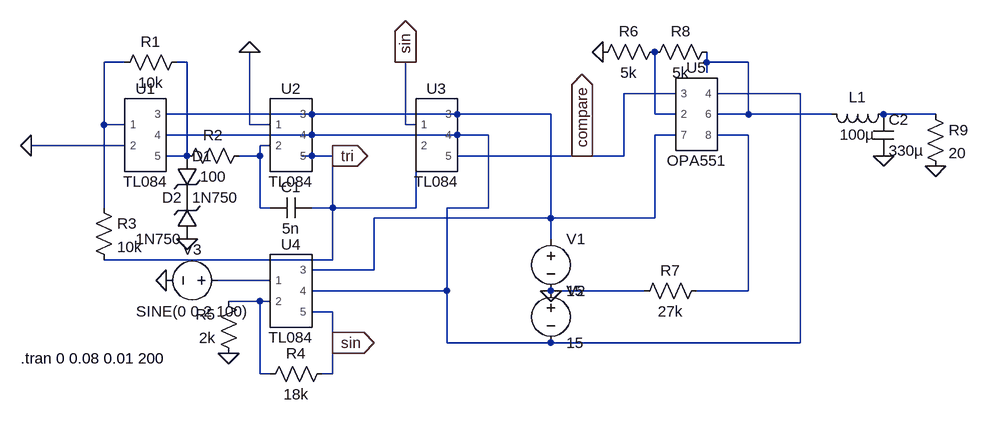
[diagram p0: schematic d类功放思考题.asc]
d类功放思考题.asc, the LTspice schematic file:
Version 4
SHEET 1 1368 680
WIRE 64 -16 32 -16
WIRE 160 -16 144 -16
WIRE 960 -16 960 -32
WIRE 1024 -16 960 -16
WIRE 960 0 960 -16
WIRE 912 32 832 32
WIRE 1104 32 976 32
WIRE 352 64 128 64
WIRE 576 64 352 64
WIRE 720 64 576 64
WIRE 880 64 880 -32
WIRE 912 64 880 64
WIRE 1024 64 1024 -16
WIRE 1024 64 976 64
WIRE 1152 64 1024 64
WIRE 1312 64 1232 64
WIRE 32 80 32 -16
WIRE 64 80 32 80
WIRE 256 80 256 -32
WIRE 288 80 256 80
WIRE 496 80 496 -16
WIRE 512 80 496 80
WIRE 352 96 128 96
WIRE 576 96 352 96
WIRE 624 96 576 96
WIRE 912 96 880 96
WIRE 1024 96 976 96
WIRE 64 112 -80 112
WIRE 288 112 272 112
WIRE 160 128 160 -16
WIRE 160 128 128 128
WIRE 272 128 272 112
WIRE 272 128 240 128
WIRE 352 128 336 128
WIRE 384 128 352 128
WIRE 768 128 576 128
WIRE 832 128 832 32
WIRE 832 128 768 128
WIRE 32 208 32 80
WIRE 272 208 272 128
WIRE 288 208 272 208
WIRE 384 208 384 128
WIRE 384 208 352 208
WIRE 512 208 512 112
WIRE 512 208 384 208
WIRE 624 208 624 96
WIRE 624 208 560 208
WIRE 720 224 720 64
WIRE 720 224 448 224
WIRE 880 224 880 96
WIRE 880 224 720 224
WIRE 720 256 720 224
WIRE 384 288 384 208
WIRE 384 288 32 288
WIRE 448 304 448 224
WIRE 448 304 352 304
WIRE 288 320 208 320
WIRE 560 336 560 208
WIRE 560 336 352 336
WIRE 864 336 720 336
WIRE 1024 336 1024 96
WIRE 1024 336 944 336
WIRE 272 352 224 352
WIRE 288 352 272 352
WIRE 384 368 352 368
WIRE 384 416 384 368
WIRE 560 416 560 336
WIRE 720 416 560 416
WIRE 1104 416 1104 32
WIRE 1104 416 720 416
WIRE 272 464 272 352
WIRE 288 464 272 464
WIRE 384 464 384 416
WIRE 384 464 368 464
FLAG 720 336 0
FLAG -80 112 0
FLAG 160 256 0
FLAG 256 -32 0
FLAG 384 128 tri
IOPIN 384 128 Out
FLAG 128 320 0
FLAG 224 432 0
FLAG 384 416 sin
IOPIN 384 416 Out
FLAG 496 -16 sin
IOPIN 496 -16 Out
FLAG 768 128 compare
IOPIN 768 128 Out
FLAG 800 -32 0
FLAG 1232 128 0
FLAG 1312 144 0
SYMBOL TL084 96 96 R0
SYMATTR InstName U1
SYMBOL TL084 320 96 R0
SYMATTR InstName U2
SYMBOL TL084 544 96 R0
SYMATTR InstName U3
SYMBOL TL084 320 336 R0
SYMATTR InstName U4
SYMBOL voltage 720 240 R0
WINDOW 123 0 0 Left 0
WINDOW 39 0 0 Left 0
SYMATTR InstName V1
SYMATTR Value 15
SYMBOL voltage 720 320 R0
WINDOW 123 0 0 Left 0
WINDOW 39 0 0 Left 0
SYMATTR InstName V2
SYMATTR Value 15
SYMBOL res 160 -32 R90
WINDOW 0 0 56 VBottom 2
WINDOW 3 32 56 VTop 2
SYMATTR InstName R1
SYMATTR Value 10k
SYMBOL zener 144 128 R0
SYMATTR InstName D1
SYMATTR Value 1N750
SYMATTR Description Diode
SYMATTR Type diode
SYMBOL zener 176 256 R180
WINDOW 0 24 64 Left 2
WINDOW 3 24 0 Left 2
SYMATTR InstName D2
SYMATTR Value 1N750
SYMATTR Description Diode
SYMATTR Type diode
SYMBOL res 256 112 R90
WINDOW 0 0 56 VBottom 2
WINDOW 3 32 56 VTop 2
SYMATTR InstName R2
SYMATTR Value 100
SYMBOL cap 352 192 R90
WINDOW 0 0 32 VBottom 2
WINDOW 3 32 32 VTop 2
SYMATTR InstName C1
SYMATTR Value 5n
SYMBOL res 16 192 R0
SYMATTR InstName R3
SYMATTR Value 10k
SYMBOL voltage 224 320 R90
WINDOW 0 -32 56 VBottom 2
WINDOW 3 32 56 VTop 2
WINDOW 123 0 0 Left 0
WINDOW 39 0 0 Left 0
SYMATTR InstName V3
SYMATTR Value SINE(0 0.2 100)
SYMBOL res 384 448 R90
WINDOW 0 0 56 VBottom 2
WINDOW 3 32 56 VTop 2
SYMATTR InstName R4
SYMATTR Value 18k
SYMBOL res 240 448 R180
WINDOW 0 36 76 Left 2
WINDOW 3 36 40 Left 2
SYMATTR InstName R5
SYMATTR Value 2k
SYMBOL res 960 320 R90
WINDOW 0 0 56 VBottom 2
WINDOW 3 32 56 VTop 2
SYMATTR InstName R7
SYMATTR Value 27k
SYMBOL res 896 -48 R90
WINDOW 0 0 56 VBottom 2
WINDOW 3 32 56 VTop 2
SYMATTR InstName R6
SYMATTR Value 5k
SYMBOL res 976 -48 R90
WINDOW 0 0 56 VBottom 2
WINDOW 3 32 56 VTop 2
SYMATTR InstName R8
SYMATTR Value 5k
SYMBOL ind 1248 48 R90
WINDOW 0 5 56 VBottom 2
WINDOW 3 32 56 VTop 2
SYMATTR InstName L1
SYMATTR Value 100µ
SYMBOL cap 1216 64 R0
SYMATTR InstName C2
SYMATTR Value 330µ
SYMBOL res 1296 48 R0
SYMATTR InstName R9
SYMATTR Value 20
SYMBOL OPA551 944 64 R0
SYMATTR InstName U5
TEXT -96 440 Left 2 !.tran 0 0.08 0.01 200

The netlist it stands for:
* d类功放思考题.asc
XU1 N001 0 N005 N004 N002 TL084  ; pins 1 2 3 4 5
XU2 0 N009 N005 N004 tri TL084  ; pins 1 2 3 4 5
XU3 sin tri N005 N004 compare TL084  ; pins 1 2 3 4 5
XU4 N010 N011 N005 N004 sin TL084  ; pins 1 2 3 4 5
V1 N005 0 15
V2 0 N004 15
R1 N002 N001 10k
D1 N002 P001 1N750
D2 0 P001 1N750
R2 N009 N002 100
C1 tri N009 5n
R3 N001 tri 10k
V3 N010 0 SINE(0 0.2 100)
R4 sin N011 18k
R5 0 N011 2k
R7 N008 0 27k
R6 N006 0 5k
R8 N003 N006 5k
L1 N007 N003 100µ
C2 N007 0 330µ
R9 N007 0 20
XU5 compare N006 N005 N004 N003 N008 OPA551  ; pins 3 2 7 4 6 8
.model D D
.lib standard.dio
.tran 0 0.08 0.01 200
.lib C:\Users\Aristotle\Documents\LTspice\TL084.301
.lib D:\Êý¾Ý\wendang\Ñ§Ï°\ÏÖ\Ä£µçÊµÑé\OPA551.LIB
.backanno
.end